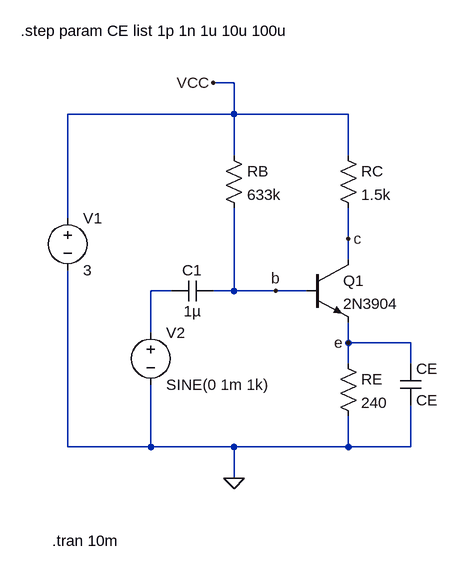
[diagram p0: schematic 01_Bipolar_Biasing_part_8.asc]
01_Bipolar_Biasing_part_8.asc, the LTspice schematic file:
Version 4
SHEET 1 880 816
WIRE 384 96 352 96
WIRE 384 144 384 96
WIRE 384 144 128 144
WIRE 560 144 384 144
WIRE 384 208 384 144
WIRE 560 208 560 144
WIRE 128 304 128 144
WIRE 560 336 560 288
WIRE 560 368 560 336
WIRE 288 416 256 416
WIRE 384 416 384 288
WIRE 384 416 352 416
WIRE 448 416 384 416
WIRE 496 416 448 416
WIRE 256 480 256 416
WIRE 560 496 560 464
WIRE 656 496 560 496
WIRE 560 528 560 496
WIRE 656 528 656 496
WIRE 128 656 128 384
WIRE 256 656 256 560
WIRE 256 656 128 656
WIRE 384 656 256 656
WIRE 560 656 560 608
WIRE 560 656 384 656
WIRE 656 656 656 592
WIRE 656 656 560 656
WIRE 384 704 384 656
FLAG 560 336 c
FLAG 384 704 0
FLAG 448 416 b
FLAG 352 96 VCC
FLAG 560 496 e
SYMBOL voltage 128 288 R0
WINDOW 123 0 0 Left 0
WINDOW 39 0 0 Left 0
SYMATTR InstName V1
SYMATTR Value 3
SYMBOL res 544 192 R0
SYMATTR InstName RC
SYMATTR Value 1.5k
SYMBOL npn 496 368 R0
SYMATTR InstName Q1
SYMATTR Value 2N3904
SYMBOL res 368 192 R0
SYMATTR InstName RB
SYMATTR Value 633k
SYMBOL res 544 512 R0
SYMATTR InstName RE
SYMATTR Value 240
SYMBOL voltage 256 464 R0
WINDOW 123 0 0 Left 0
WINDOW 39 0 0 Left 0
SYMATTR InstName V2
SYMATTR Value SINE(0 1m 1k)
SYMBOL cap 352 400 R90
WINDOW 0 0 32 VBottom 2
WINDOW 3 32 32 VTop 2
SYMATTR InstName C1
SYMATTR Value 1µ
SYMBOL cap 640 528 R0
SYMATTR InstName CE
SYMATTR Value CE
TEXT 104 800 Left 2 !.tran 10m
TEXT 56 16 Left 2 !.step param CE list 1p 1n 1u 10u 100u

The netlist it stands for:
* 01_Bipolar_Biasing_part_8.asc
V1 VCC 0 3
RC VCC c 1.5k
Q1 c b e 0 2N3904
RB VCC b 633k
RE e 0 240
V2 N001 0 SINE(0 1m 1k)
C1 b N001 1µ
CE e 0 CE
.model NPN NPN
.model PNP PNP
.lib standard.bjt
.tran 10m
.step param CE list 1p 1n 1u 10u 100u
.backanno
.end